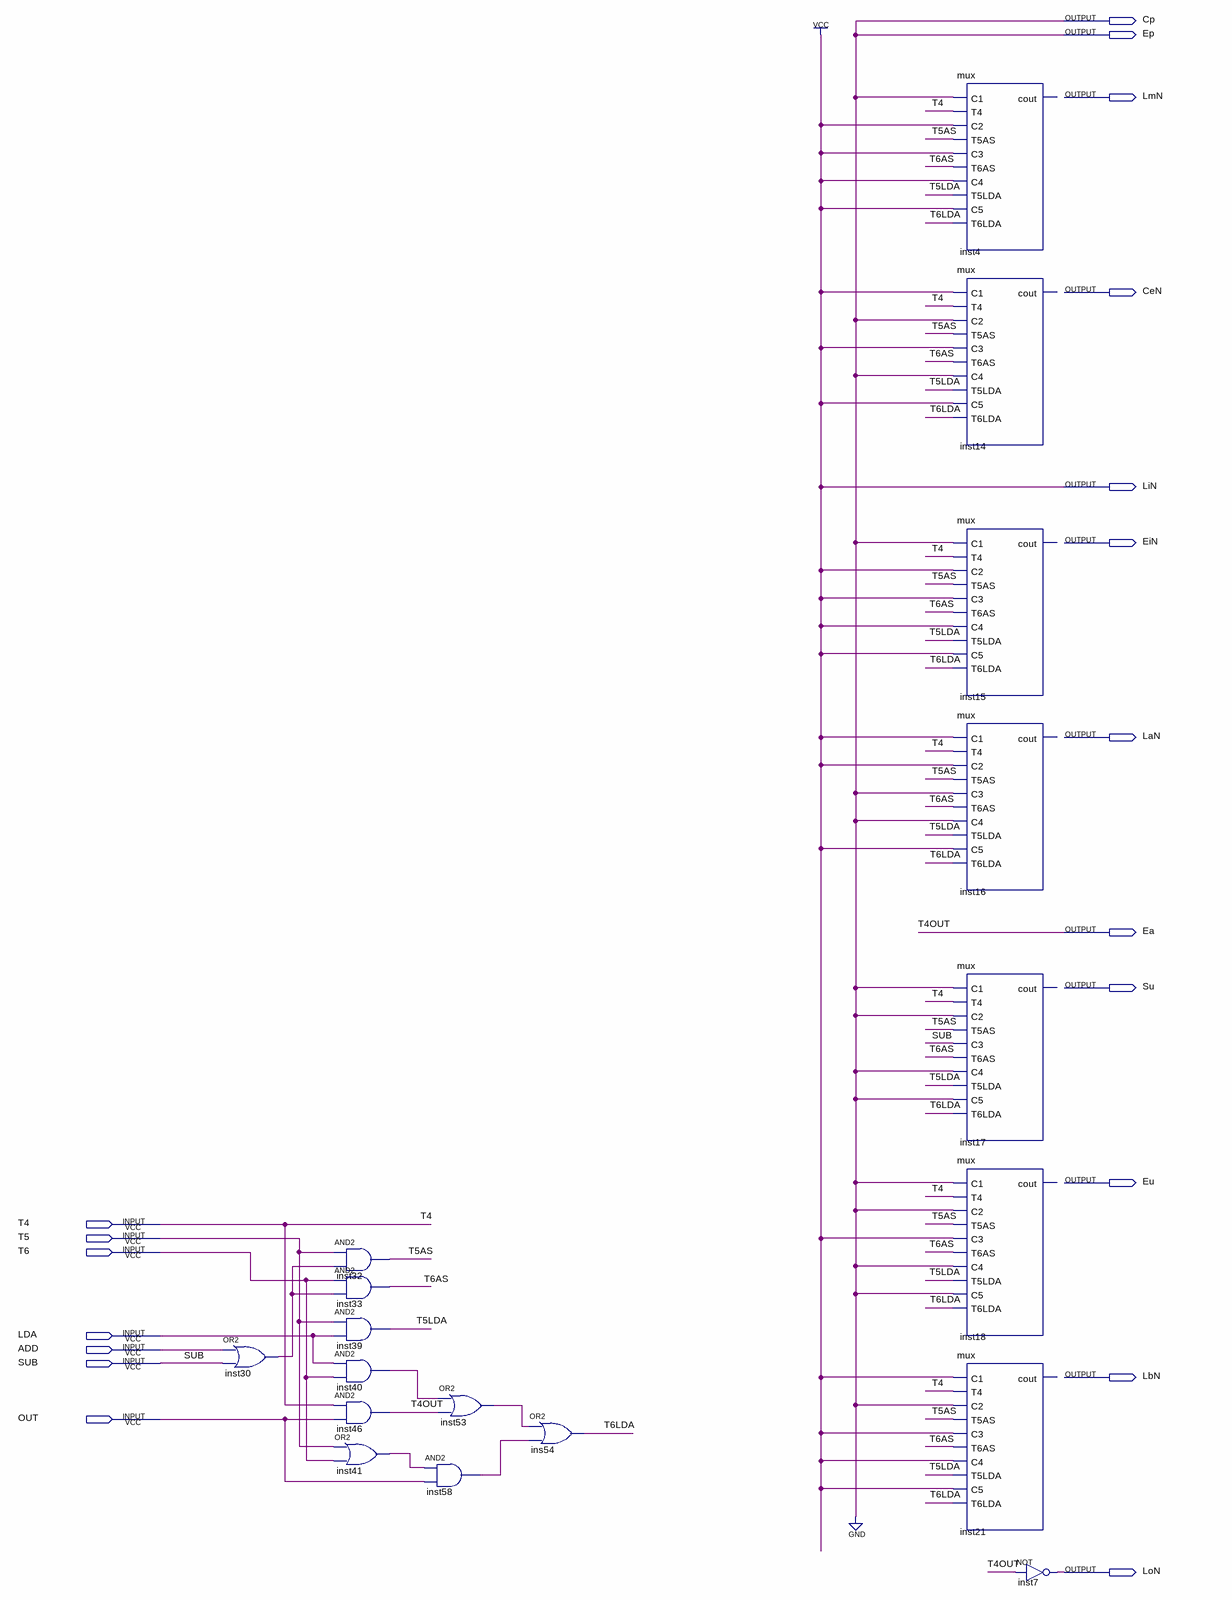
[diagram p0: schematic sheet]
// Quartus schematic clicoexecutacao.bdf as structural Verilog: 18 symbols, 19 pins
module clicoexecutacao (
  input  T4,
  input  T5,
  input  T6,
  input  LDA,
  input  ADD,
  input  SUB,
  input  OUT,
  output Cp,
  output Ep,
  output LmN,
  output CeN,
  output LiN,
  output EiN,
  output LaN,
  output Ea,
  output Su,
  output Eu,
  output LbN,
  output LoN
);

  wire inst30_out, inst40_out, inst41_out, inst53_out, inst58_out, T5AS, T5LDA, T6AS, T6LDA;

  or inst30 (inst30_out, ADD, SUB);
  and inst32 (T5AS, T5, inst30_out);
  and inst33 (T6AS, T6, inst30_out);
  and inst39 (T5LDA, T5, LDA);
  and inst40 (inst40_out, LDA, T6);
  and inst46 (Ea, T4, OUT);
  or inst41 (inst41_out, T5, T6);
  or inst53 (inst53_out, inst40_out, Ea);
  and inst58 (inst58_out, inst41_out, OUT);
  or ins54 (T6LDA, inst53_out, inst58_out);
  mux inst4 (
    .C1(1'b0), .T4(T4), .C2(1'b1), .T5AS(T5AS), .C3(1'b1), .T6AS(T6AS), .C4(1'b1), .T5LDA(T5LDA), .C5(1'b1),
    .T6LDA(T6LDA));  // open: cout
  mux inst14 (
    .C1(1'b1), .T4(T4), .C2(1'b0), .T5AS(T5AS), .C3(1'b1), .T6AS(T6AS), .C4(1'b0), .T5LDA(T5LDA), .C5(1'b1),
    .T6LDA(T6LDA));  // open: cout
  mux inst15 (
    .C1(1'b0), .T4(T4), .C2(1'b1), .T5AS(T5AS), .C3(1'b1), .T6AS(T6AS), .C4(1'b1), .T5LDA(T5LDA), .C5(1'b1),
    .T6LDA(T6LDA));  // open: cout
  mux inst16 (
    .C1(1'b1), .T4(T4), .C2(1'b1), .T5AS(T5AS), .C3(1'b0), .T6AS(T6AS), .C4(1'b0), .T5LDA(T5LDA), .C5(1'b1),
    .T6LDA(T6LDA));  // open: cout
  mux inst17 (
    .C1(1'b0), .T4(T4), .C2(1'b0), .T5AS(T5AS), .C3(SUB), .T6AS(T6AS), .C4(1'b0), .T5LDA(T5LDA), .C5(1'b0),
    .T6LDA(T6LDA));  // open: cout
  mux inst18 (
    .C1(1'b0), .T4(T4), .C2(1'b0), .T5AS(T5AS), .C3(1'b1), .T6AS(T6AS), .C4(1'b0), .T5LDA(T5LDA), .C5(1'b0),
    .T6LDA(T6LDA));  // open: cout
  mux inst21 (
    .C1(1'b1), .T4(T4), .C2(1'b0), .T5AS(T5AS), .C3(1'b1), .T6AS(T6AS), .C4(1'b1), .T5LDA(T5LDA), .C5(1'b1),
    .T6LDA(T6LDA));  // open: cout
  not inst7 (LoN, Ea);

  assign Cp = 1'b0;
  assign Ep = 1'b0;
  assign LiN = 1'b1;

  // Other names for the same wires on the sheet: T4OUT = Ea
endmodule
